# Altium schematic sheet root.SchDoc
size A4; SheetNumber: 1; SheetTotal: 5
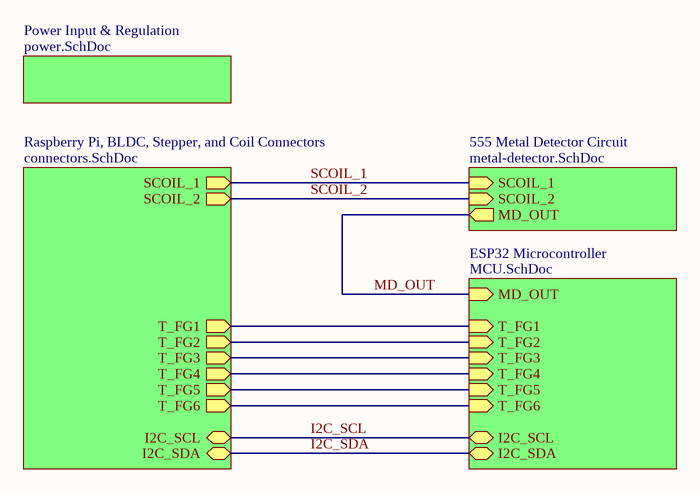
[diagram p0: root.SchDoc]

## Sub-sheets
555 Metal Detector Circuit = metal-detector.SchDoc: SCOIL_2 (in), MD_OUT (out), SCOIL_1 (in)
ESP32 Microcontroller = MCU.SchDoc: MD_OUT (in), I2C_SCL (bidir), I2C_SDA (bidir), T_FG1 (in), T_FG2 (in), T_FG3 (in), T_FG4 (in), T_FG5 (in), T_FG6 (in)
Power Input & Regulation = power.SchDoc: no entries
Raspberry Pi, BLDC, Stepper, and Coil Connectors = connectors.SchDoc: SCOIL_1 (out), SCOIL_2 (out), I2C_SCL (bidir), I2C_SDA (bidir), T_FG1 (out), T_FG2 (out), T_FG3 (out), T_FG4 (out), T_FG5 (out), T_FG6 (out)

## Nets
I2C_SCL: sheet Raspberry Pi, BLDC, Stepper, and Coil Connectors/I2C_SCL, sheet ESP32 Microcontroller/I2C_SCL
I2C_SDA: sheet Raspberry Pi, BLDC, Stepper, and Coil Connectors/I2C_SDA, sheet ESP32 Microcontroller/I2C_SDA
MD_OUT: sheet 555 Metal Detector Circuit/MD_OUT, sheet ESP32 Microcontroller/MD_OUT
SCOIL_1: sheet Raspberry Pi, BLDC, Stepper, and Coil Connectors/SCOIL_1, sheet 555 Metal Detector Circuit/SCOIL_1
SCOIL_2: sheet Raspberry Pi, BLDC, Stepper, and Coil Connectors/SCOIL_2, sheet 555 Metal Detector Circuit/SCOIL_2
(unnamed): sheet Raspberry Pi, BLDC, Stepper, and Coil Connectors/T_FG1, sheet ESP32 Microcontroller/T_FG1
(unnamed): sheet Raspberry Pi, BLDC, Stepper, and Coil Connectors/T_FG2, sheet ESP32 Microcontroller/T_FG2
(unnamed): sheet Raspberry Pi, BLDC, Stepper, and Coil Connectors/T_FG3, sheet ESP32 Microcontroller/T_FG3
(unnamed): sheet Raspberry Pi, BLDC, Stepper, and Coil Connectors/T_FG4, sheet ESP32 Microcontroller/T_FG4
(unnamed): sheet Raspberry Pi, BLDC, Stepper, and Coil Connectors/T_FG5, sheet ESP32 Microcontroller/T_FG5
(unnamed): sheet Raspberry Pi, BLDC, Stepper, and Coil Connectors/T_FG6, sheet ESP32 Microcontroller/T_FG6